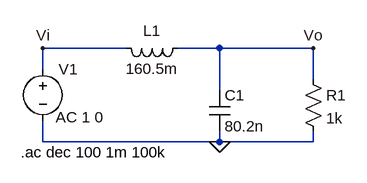
[diagram p0: schematic Liaño.asc]
Liaño.asc, the LTspice schematic file:
Version 4
SHEET 1 880 680
WIRE 96 112 -32 112
WIRE 240 112 176 112
WIRE 384 112 240 112
WIRE -32 144 -32 112
WIRE 384 160 384 112
WIRE 240 176 240 112
WIRE -32 256 -32 224
WIRE 240 256 240 240
WIRE 240 256 -32 256
WIRE 384 256 384 240
WIRE 384 256 240 256
FLAG 240 256 0
FLAG 384 112 Vo
FLAG -32 112 Vi
SYMBOL ind 192 96 R90
WINDOW 0 5 56 VBottom 2
WINDOW 3 32 56 VTop 2
SYMATTR InstName L1
SYMATTR Value 160.5m
SYMBOL cap 224 176 R0
SYMATTR InstName C1
SYMATTR Value 80.2n
SYMBOL res 368 144 R0
SYMATTR InstName R1
SYMATTR Value 1k
SYMBOL voltage -32 128 R0
WINDOW 123 20 90 Left 2
WINDOW 39 0 0 Left 0
SYMATTR InstName V1
SYMATTR Value ""
SYMATTR Value2 AC 1 0
TEXT -66 272 Left 2 !.ac dec 100 1m 100k

The netlist it stands for:
* Liaño.asc
L1 Vo Vi 160.5m
C1 Vo 0 80.2n
R1 Vo 0 1k
V1 Vi 0 AC 1 0
.ac dec 100 1m 100k
.backanno
.end